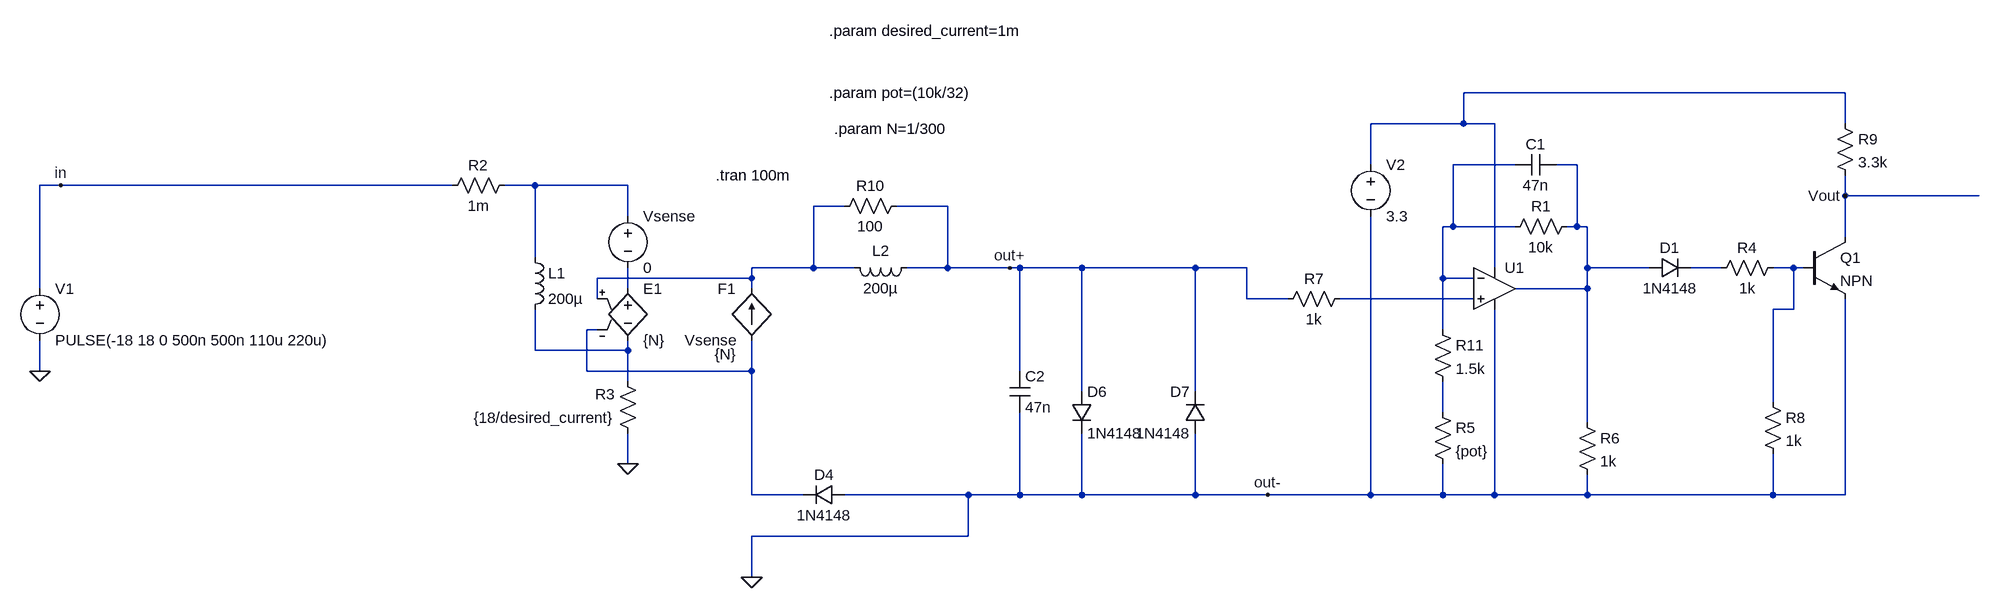
[diagram p0: schematic CurrentSense_Sampled.asc]
CurrentSense_Sampled.asc, the LTspice schematic file:
Version 4
SHEET 1 2460 776
WIRE 2032 -48 1440 -48
WIRE 1440 0 1440 -48
WIRE 1440 0 1296 0
WIRE 1488 0 1440 0
WIRE 2032 0 2032 -48
WIRE 1296 64 1296 0
WIRE 1520 64 1424 64
WIRE 1616 64 1584 64
WIRE -736 96 -768 96
WIRE -128 96 -736 96
WIRE 0 96 -48 96
WIRE 144 96 0 96
WIRE 2032 112 2032 80
WIRE 2240 112 2032 112
WIRE 480 128 432 128
WIRE 640 128 560 128
WIRE 144 144 144 96
WIRE 1424 160 1424 64
WIRE 1424 160 1408 160
WIRE 1520 160 1424 160
WIRE 1616 160 1616 64
WIRE 1616 160 1600 160
WIRE 1632 160 1616 160
WIRE 2032 176 2032 112
WIRE 0 208 0 96
WIRE 432 224 432 128
WIRE 432 224 336 224
WIRE 496 224 432 224
WIRE 640 224 640 128
WIRE 640 224 576 224
WIRE 736 224 640 224
WIRE 752 224 736 224
WIRE 848 224 752 224
WIRE 1024 224 848 224
WIRE 1104 224 1024 224
WIRE 1488 224 1488 0
WIRE 1632 224 1632 160
WIRE 1728 224 1632 224
WIRE 1840 224 1792 224
WIRE 1952 224 1920 224
WIRE 1968 224 1952 224
WIRE 336 240 336 224
WIRE 336 240 96 240
WIRE 1408 240 1408 160
WIRE 1456 240 1408 240
WIRE -768 256 -768 96
WIRE 144 256 144 224
WIRE 336 256 336 240
WIRE 1632 256 1632 224
WIRE 1632 256 1520 256
WIRE 96 272 96 240
WIRE 1104 272 1104 224
WIRE 1168 272 1104 272
WIRE 1456 272 1248 272
WIRE 1952 288 1952 224
WIRE 1952 288 1920 288
WIRE 96 320 80 320
WIRE 1408 320 1408 240
WIRE 0 352 0 288
WIRE 144 352 144 336
WIRE 144 352 0 352
WIRE -768 384 -768 336
WIRE 80 384 80 320
WIRE 336 384 336 336
WIRE 336 384 80 384
WIRE 752 384 752 224
WIRE 144 400 144 352
WIRE 848 416 848 224
WIRE 1024 416 1024 224
WIRE 1920 432 1920 288
WIRE 1408 448 1408 400
WIRE 1632 464 1632 256
WIRE 144 528 144 480
WIRE 336 576 336 384
WIRE 416 576 336 576
WIRE 672 576 480 576
WIRE 752 576 752 448
WIRE 752 576 672 576
WIRE 848 576 848 480
WIRE 848 576 752 576
WIRE 1024 576 1024 480
WIRE 1024 576 848 576
WIRE 1136 576 1024 576
WIRE 1296 576 1296 144
WIRE 1296 576 1136 576
WIRE 1408 576 1408 528
WIRE 1408 576 1296 576
WIRE 1488 576 1488 288
WIRE 1488 576 1408 576
WIRE 1632 576 1632 544
WIRE 1632 576 1488 576
WIRE 1920 576 1920 512
WIRE 1920 576 1632 576
WIRE 2032 576 2032 272
WIRE 2032 576 1920 576
WIRE 672 640 672 576
WIRE 672 640 336 640
WIRE 336 704 336 640
FLAG -768 384 0
FLAG 144 528 0
FLAG 336 704 0
FLAG 736 224 out+
FLAG -736 96 in
FLAG 1136 576 out-
FLAG 2032 112 Vout
SYMBOL e 144 240 R0
SYMATTR InstName E1
SYMATTR Value {N}
SYMBOL f 336 336 R180
WINDOW 0 24 80 Left 2
WINDOW 3 24 0 Left 2
WINDOW 123 24 -22 Left 2
SYMATTR InstName F1
SYMATTR Value Vsense
SYMATTR Value2 {N}
SYMBOL voltage 144 128 R0
SYMATTR InstName Vsense
SYMATTR Value 0
SYMBOL voltage -768 240 R0
SYMATTR InstName V1
SYMATTR Value PULSE(-18 18 0 500n 500n 110u 220u)
SYMBOL Res -32 80 R90
WINDOW 0 0 56 VBottom 2
WINDOW 3 32 56 VTop 2
SYMATTR InstName R2
SYMATTR Value 1m
SYMBOL Res 160 496 R180
WINDOW 0 36 76 Left 2
WINDOW 3 36 40 Left 2
SYMATTR InstName R3
SYMATTR Value {18/desired_current}
SYMBOL ind -16 192 R0
SYMATTR InstName L1
SYMATTR Value 200µ
SYMBOL diode 480 560 R90
WINDOW 0 0 32 VBottom 2
WINDOW 3 32 32 VTop 2
SYMATTR InstName D4
SYMATTR Value 1N4148
SYMBOL cap 736 384 R0
SYMATTR InstName C2
SYMATTR Value 47n
SYMBOL ind 592 208 R90
WINDOW 0 5 56 VBottom 2
WINDOW 3 32 56 VTop 2
SYMATTR InstName L2
SYMATTR Value 200µ
SYMBOL Res 576 112 R90
WINDOW 0 0 56 VBottom 2
WINDOW 3 32 56 VTop 2
SYMATTR InstName R10
SYMATTR Value 100
SYMBOL diode 832 416 R0
SYMATTR InstName D6
SYMATTR Value 1N4148
SYMBOL diode 1040 480 R180
WINDOW 0 24 64 Left 2
WINDOW 3 24 0 Left 2
SYMATTR InstName D7
SYMATTR Value 1N4148
SYMBOL OpAmps/UniversalOpAmp2 1488 256 R0
SYMATTR InstName U1
SYMBOL voltage 1296 48 R0
SYMATTR InstName V2
SYMATTR Value 3.3
SYMBOL Res 1616 144 R90
WINDOW 0 0 56 VBottom 2
WINDOW 3 32 56 VTop 2
SYMATTR InstName R1
SYMATTR Value 10k
SYMBOL Res 1392 432 R0
SYMATTR InstName R5
SYMATTR Value {pot}
SYMBOL Res 1616 448 R0
SYMATTR InstName R6
SYMATTR Value 1k
SYMBOL Res 1264 256 R90
WINDOW 0 0 56 VBottom 2
WINDOW 3 32 56 VTop 2
SYMATTR InstName R7
SYMATTR Value 1k
SYMBOL cap 1584 48 R90
WINDOW 0 0 32 VBottom 2
WINDOW 3 32 32 VTop 2
SYMATTR InstName C1
SYMATTR Value 47n
SYMBOL npn 1968 176 R0
SYMATTR InstName Q1
SYMBOL Res 1936 208 R90
WINDOW 0 0 56 VBottom 2
WINDOW 3 32 56 VTop 2
SYMATTR InstName R4
SYMATTR Value 1k
SYMBOL diode 1728 240 R270
WINDOW 0 32 32 VTop 2
WINDOW 3 0 32 VBottom 2
SYMATTR InstName D1
SYMATTR Value 1N4148
SYMBOL Res 1904 416 R0
SYMATTR InstName R8
SYMATTR Value 1k
SYMBOL Res 2016 -16 R0
SYMATTR InstName R9
SYMATTR Value 3.3k
SYMBOL Res 1392 304 R0
SYMATTR InstName R11
SYMATTR Value 1.5k
TEXT 280 80 Left 2 !.tran 100m
TEXT 464 8 Left 2 !.param N=1/300
TEXT 456 -48 Left 2 !.param pot=(10k/32)
TEXT 456 -144 Left 2 !.param desired_current=1m

The netlist it stands for:
* CurrentSense_Sampled.asc
E1 N008 N011 N005 N010 {N}
F1 N010 N005 Vsense {N}
Vsense N004 N008 0
V1 in 0 PULSE(-18 18 0 500n 500n 110u 220u)
R2 N004 in 1m
R3 0 N011 {18/desired_current}
L1 N004 N011 200µ
D4 0 N010 1N4148
C2 out+ 0 47n
L2 out+ N005 200µ
R10 out+ N005 100
D6 out+ 0 1N4148
D7 0 out+ 1N4148
XU1 N009 N002 N001 0 N003 level2 Avol=1Meg GBW=10Meg Slew=10Meg Ilimit=25m Rail=0 Vos=0 En=0 Enk=0 In=0 Ink=0 Rin=500Meg  ; pins In+ In- V+ V- OUT
V2 N001 0 3.3
R1 N003 N002 10k
R5 N012 0 {pot}
R6 N003 0 1k
R7 N009 out+ 1k
C1 N003 N002 47n
Q1 Vout N007 0 0 NPN
R4 N007 N006 1k
D1 N003 N006 1N4148
R8 N007 0 1k
R9 N001 Vout 3.3k
R11 N002 N012 1.5k
.model D D
.lib standard.dio
.model NPN NPN
.model PNP PNP
.lib standard.bjt
.tran 100m
.param N=1/300
.param pot=(10k/32)
.param desired_current=1m
.lib UniversalOpAmp2.lib
.backanno
.end